# EAGLE design ADE7753Schematic-ATMEGA (EAGLE 6.5.0)
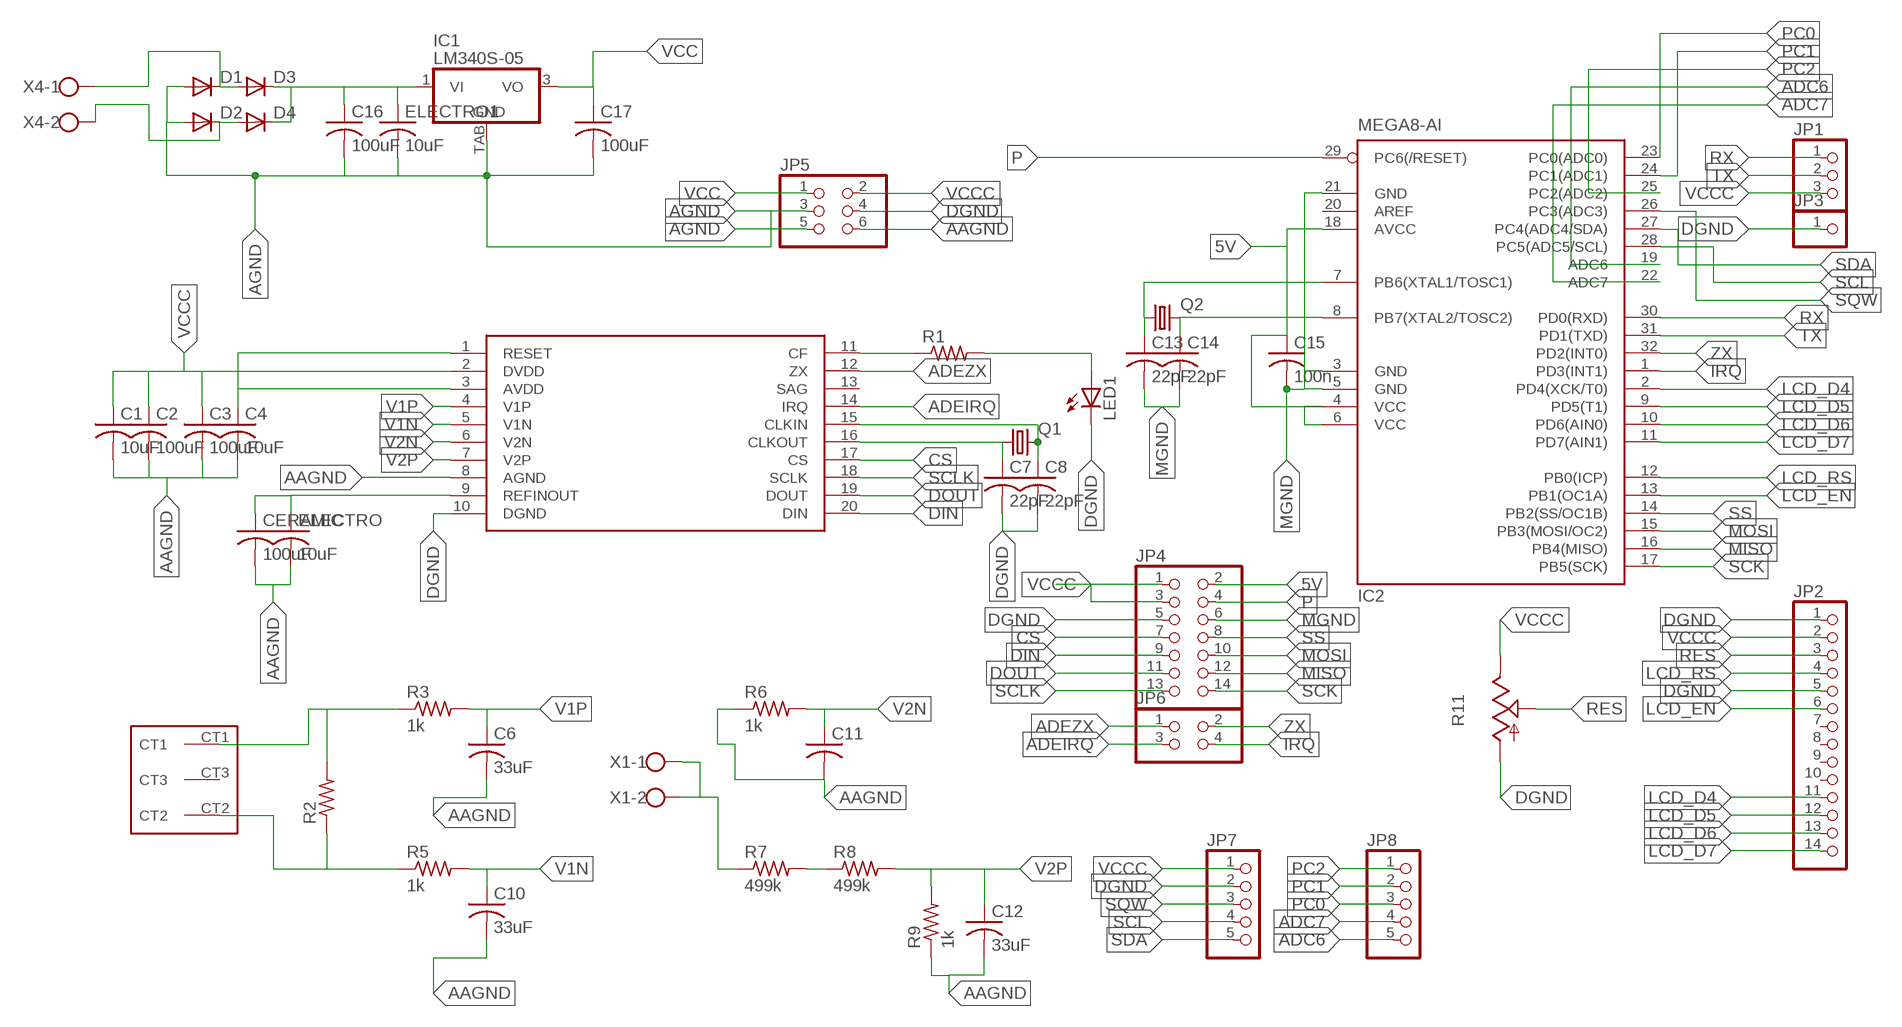
[diagram p0: schematic, sheet 1]

## Parts
C1  10uF  C-US025-030X050  [C025-030X050]
C2  100uF  C-USC0603K  [C0603K]
C3  100uF  C-USC0603K  [C0603K]
C4  10uF  C-US025-030X050  [C025-030X050]
C6  33uF  C-USC0805K  [C0805K]
C7  22pF  C-USC0603K  [C0603K]
C8  22pF  C-USC0603K  [C0603K]
C10  33uF  C-USC0805K  [C0805K]
C11  C-USC0805K  [C0805K]
C12  33uF  C-USC0805K  [C0805K]
C13  22pF  C-USC0603K  [C0603K]
C14  22pF  C-USC0603K  [C0603K]
C15  100n  C-USC0603K  [C0603K]
C16  100uF  C-USC0603K  [C0603K]
C17  100uF  C-USC0603K  [C0603K]
CERAMIC  100uF  C-USC0603K  [C0603K]
D1  DIODE-SMB  [SMB]
D2  DIODE-SMB  [SMB]
D3  DIODE-SMB  [SMB]
D4  DIODE-SMB  [SMB]
ELECTRO  10uF  C-US025-030X050  [C025-030X050]
ELECTRO1  10uF  C-US025-030X050  [C025-030X050]
IC1  LM340S-05  [TO263-3]
IC2  MEGA8-AI  [TQFP32-08]
JP1  PINHD-1X3CB  [1X03-CLEANBIG]
JP2  PINHD-1X14-CB  [1X14-CB]
JP3  PINHD-1X1CB  [1X01-CLEANBIG]
JP4  PINHD-2X7  [2X07]
JP5  PINHD-2X3  [2X03]
JP6  PINHD-2X2  [2X02]
JP7  PINHD-1X5  [1X05]
JP8  PINHD-1X5  [1X05]
LED1  LEDCHIPLED_0805  [CHIPLED_0805]
Q1  CRYSTALHC49S  [HC49/S]
Q2  CRYSTALHC49UP  [HC49UP]
R1  R-US_R1206  [R1206]
R2  R-US_0309/12  [0309/12]
R3  1k  R-US_R1206  [R1206]
R5  1k  R-US_R1206  [R1206]
R6  1k  R-US_R1206  [R1206]
R7  499k  R-US_R1206  [R1206]
R8  499k  R-US_R1206  [R1206]
R9  1k  R-US_R1206  [R1206]
R11  TRIM_US-RJ9W  [RJ9W]
U$1  ADE7753  [SSOP20]
U$2  CURRENTXFORMER  [3PINS]
X1  W239-302  [W239-302]
X4  W237-102  [W237-102]

## Nets
5V: C15.1 IC2.4(VCC) IC2.6(VCC) IC2.18(AVCC) JP4.2
AAGND: C1.2 C2.2 C3.2 C4.2 C6.2 C10.2 C11.2 C12.2 CERAMIC.2 ELECTRO.2 JP5.6 R6.1 R9.1 U$1.8(AGND)
ADC6: IC2.19(ADC6) JP8.5
ADC7: IC2.22(ADC7) JP8.4
ADEIRQ: JP6.3 U$1.14(IRQ)
ADEZX: JP6.1 U$1.12(ZX)
AGND: C16.2 C17.2 D1.A D2.A ELECTRO1.2 IC1.TAB(GND) JP5.3 JP5.5
CS: JP4.7 U$1.17(CS)
DGND: C7.2 C8.2 JP2.1 JP2.5 JP3.1 JP4.5 JP5.4 JP7.2 LED1.C R11.A U$1.10(DGND)
DIN: JP4.9 U$1.20(DIN)
DOUT: JP4.11 U$1.19(DOUT)
IRQ: IC2.1(PD3(INT1)) JP6.4
LCD_D4: IC2.2(PD4(XCK/T0)) JP2.11
LCD_D5: IC2.9(PD5(T1)) JP2.12
LCD_D6: IC2.10(PD6(AIN0)) JP2.13
LCD_D7: IC2.11(PD7(AIN1)) JP2.14
LCD_EN: IC2.13(PB1(OC1A)) JP2.6
LCD_RS: IC2.12(PB0(ICP)) JP2.4
MGND: C13.2 C14.2 C15.2 IC2.3(GND) IC2.5(GND) IC2.21(GND) JP4.6
MISO: IC2.16(PB4(MISO)) JP4.12
MOSI: IC2.15(PB3(MOSI/OC2)) JP4.10
N$1: D1.C D3.A X4.1
N$2: C8.1 Q1.2 U$1.15(CLKIN)
N$3: CERAMIC.1 ELECTRO.1 U$1.9(REFINOUT)
N$4: C7.1 Q1.1 U$1.16(CLKOUT)
N$5: R1.1 U$1.11(CF)
N$6: LED1.A R1.2
N$7: R2.2 R3.1 U$2.CT1
N$9: R2.1 R5.1 U$2.CT2
N$11: R7.2 R8.1
N$12: C14.1 IC2.8(PB7(XTAL2/TOSC2)) Q2.2
N$13: R7.1 X1.1 X1.2
N$14: C13.1 IC2.7(PB6(XTAL1/TOSC1)) Q2.1
N$16: D2.C D4.A X4.2
N$20: C16.1 D3.C D4.C ELECTRO1.1 IC1.1(VI)
P: IC2.29(PC6(/RESET)) JP4.4
PC0: IC2.23(PC0(ADC0)) JP8.3
PC1: IC2.24(PC1(ADC1)) JP8.2
PC2: IC2.25(PC2(ADC2)) JP8.1
RES: JP2.3 R11.S
RX: IC2.30(PD0(RXD)) JP1.1
SCK: IC2.17(PB5(SCK)) JP4.14
SCL: IC2.28(PC5(ADC5/SCL)) JP7.4
SCLK: JP4.13 U$1.18(SCLK)
SDA: IC2.27(PC4(ADC4/SDA)) JP7.5
SQW: IC2.26(PC3(ADC3)) JP7.3
SS: IC2.14(PB2(SS/OC1B)) JP4.8
TX: IC2.31(PD1(TXD)) JP1.2
V1N: C10.1 R5.2 U$1.5(V1N)
V1P: C6.1 R3.2 U$1.4(V1P)
V2N: C11.1 R6.2 U$1.6(V2N)
V2P: C12.1 R8.2 R9.2 U$1.7(V2P)
VCC: C17.1 IC1.3(VO) JP5.1
VCCC: C1.1 C2.1 C3.1 C4.1 JP1.3 JP2.2 JP4.1 JP4.3 JP5.2 JP7.1 R11.E U$1.1(RESET) U$1.2(DVDD) U$1.3(AVDD)
ZX: IC2.32(PD2(INT0)) JP6.2
Unconnected: IC2.20(AREF) JP2.7 JP2.8 JP2.9 JP2.10 U$1.13(SAG) U$2.CT3

## Library data of the parts
C1-C4 C6-C8 C10-C17 CERAMIC ELECTRO ELECTRO1 = rcl:C-US: CAPACITOR, American symbol
D1-D4 = diode:DIODE-: DIODE
IC1 = linear:LM340?-*: Positive VOLTAGE REGULATOR Source: http://cache.national.com/ds/LM/LM340.pdf
IC2 = atmel:MEGA8: MICROCONTROLLER 8 Kbytes FLASH, 1 kbytes SRAM, 512 bytes EEPROM, USART, 6-channel 10 bit ADC, 2-channel 8 bit ADC Pin compatible with Atmega48, ATMega88, ATMega168 Source: avr.lbr; MPN: ATMEGA8-16AU; OC_FARNELL: 9171371; OC_NEWARK: 73M8863
JP1 = adafruit:PINHD-1X3: PIN HEADER
JP2 = adafruit:PINHD-1X14: PIN HEADER
JP3 = adafruit:PINHD-1X1: Pin header 1x1 for 0.1" spacing With round pins
JP4 = pinhead:PINHD-2X7: PIN HEADER
JP5 = pinhead:PINHD-2X3: PIN HEADER
JP6 = pinhead:PINHD-2X2: PIN HEADER
JP7 JP8 = pinhead:PINHD-1X5: PIN HEADER
LED1 = adafruit:LED: LED OSRAM: - CHIPLED LG R971, LG N971, LY N971, LG Q971, LY Q971, LO R971, LY R971 LH N974, LH R974 LS Q976, LO Q976, LY Q976 LO Q996 - Hyper CHIPLED LW Q18S LB Q993, LB Q99A, LB R99A - SideLED LS A670, LO A670, LY A670, LG A670, LP A670 LB A673, LV A673, LT A673, LW A673 LH A674 LY A675 LS A676, LA A676, LO A676, LY A676, LW A676 LS A679, LY A679, LG A679 - Hyper Micro SIDELED® LS Y876, LA Y876, LO Y876, LY Y876 LT Y87S - SmartLED LW L88C, LW L88S LB L89C, LB L89S, LG L890 LS L89K, LO L89K, LY L89K LS L896, LA L896, LO L896, LY L896 - TOPLED LS T670, LO T670, LY T670, LG T670, LP T670 LSG T670, LSP T670, LSY T670, LOP T670, LYG T670 LG T671, LOG T671, LSG T671 LB T673, LV T673, LT T673, LW T673 LH T674 LS T676, LA T676, LO T676, LY T676, LB T676, LH T676, LSB T676, LW T676 LB T67C, LV T67C, LT T67C, LS T67K, LO T67K, LY T67K, LW E67C LS E67B, LA E67B, LO E67B, LY E67B, LB E67C, LV E67C, LT E67C LW T67C LS T679, LY T679, LG T679 LS T770, LO T770, LY T770, LG T770, LP T770 LB T773, LV T773, LT T773, LW T773 LH T774 LS E675, LA E675, LY E675, LS T675 LS T776, LA T776, LO T776, LY T776, LB T776 LHGB T686 LT T68C, LB T68C - Hyper Mini TOPLED® LB M676 - Mini TOPLED Santana® LG M470 LS M47K, LO M47K, LY M47K Source: http://www.osram.convergy.de/
Q1 = adafruit:CRYSTAL: CRYSTAL; OC_FARNELL: 1667008; OC_NEWARK: unknown
Q2 = crystal:CRYSTAL: CRYSTAL; OC_FARNELL: unknown; OC_NEWARK: unknown
R1 R3 R5-R9 = adafruit:R-US_: RESISTOR, American symbol
R2 = resistor:R-US_: RESISTOR, American symbol
R11 = pot:TRIM_US-: POTENTIOMETER
U$1 = ade7735:ADE7753
U$2 = currentxformer:CURRENTXFORMER
X1 = con-wago-500:W239-302: WAGO SCREW CLAMP; OC_FARNELL: unknown; OC_NEWARK: unknown
X4 = con-wago-500:W237-102: WAGO SCREW CLAMP; MPN: 237-102; OC_FARNELL: unknown; OC_NEWARK: 70K9898

## Net classes
0 default: clearance 0.762 mm

## Board
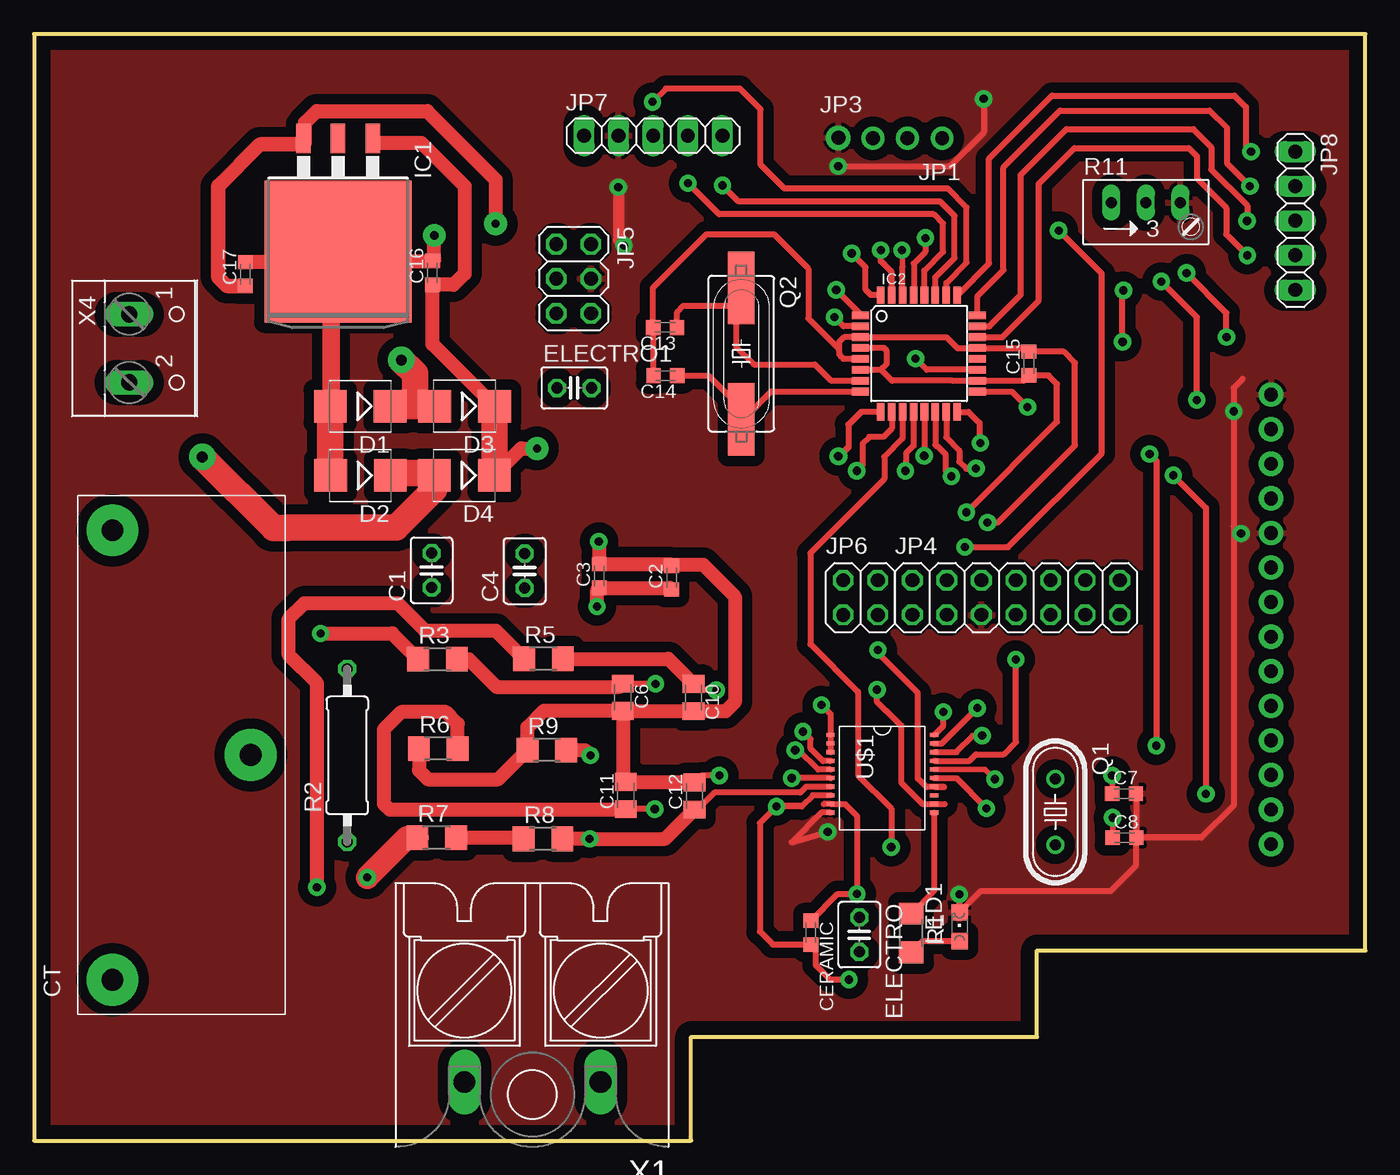
[diagram p1: board, top side]
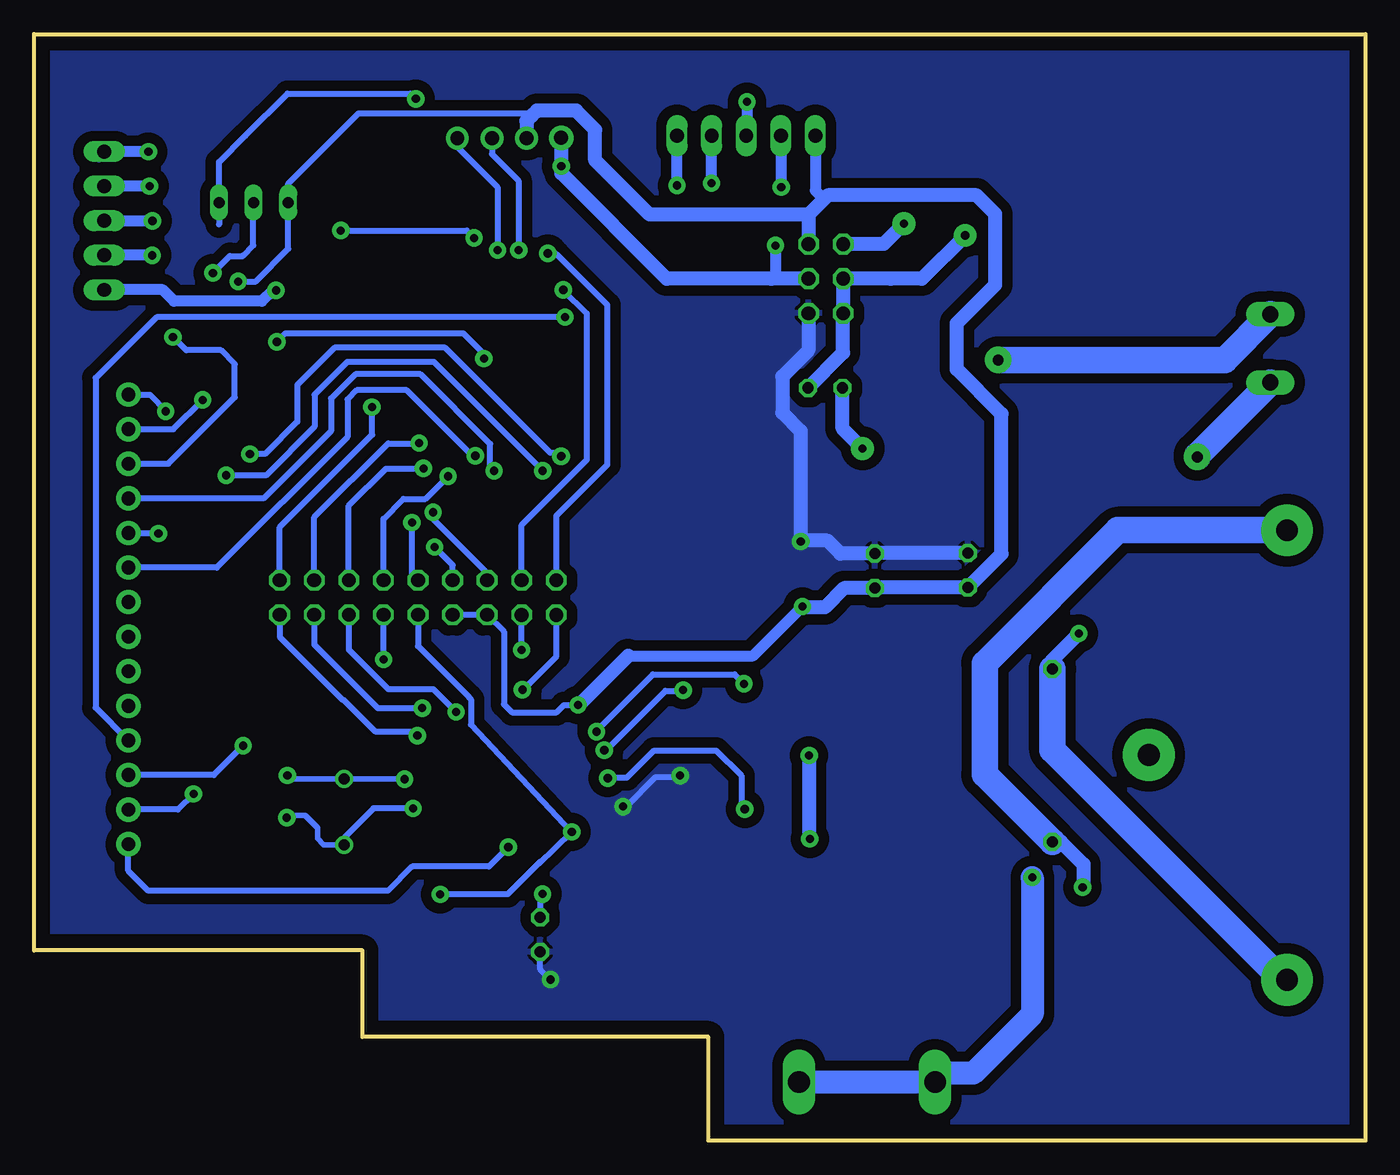
[diagram p2: board, bottom side, seen from below]

Size 97.79 x 81.28 mm. Coordinates in mm from the lower left corner, seen from the top.
Outline: 0,81.28 0,0 48.26,0 48.26,7.62 73.66,7.62 73.66,13.97 97.79,13.97 97.79,81.28 0,81.28
Copper layers (1*16): Top 0.035mm / dielectric 1.5mm / Bottom 0.035mm
Design rules "default": minimum track width 10mil, minimum drill 24mil, track to track 8mil, track to pad 8mil, pad to pad 8mil, via to via 8mil, smd to smd 8mil, copper to edge 40mil, drill to drill 8mil, minimum pad ring 10mil, minimum via ring 8mil, stop-mask expansion 4mil, vias tented up to drill 0mil, thermal gap 10mil

### Footprints (pad centres in the part's own frame; a part is rotated, then mirrored left to right if it is on the bottom)
C025-030X050 = drill 0.813 octagon: 1 -1.27,0; 2 1.27,0
C0603K = smd 1.05 x 1.08: 1 -0.875,0; 2 0.875,0
C0805K = smd 1.3 x 1.6: 1 -1,0; 2 1,0
SMB = smd 2.4 x 2.4: A 2.2,0; C -2.2,0
TO263-3 = smd 1.067 x 2.159: 1 -2.54,-5.791; 2 0,-5.791; 3 2.54,-5.791 | smd 10.8 x 10.41: TAB 0,2.54
TQFP32-08 = smd 1.27 x 0.559: 1 -4.293,2.8; 2 -4.293,2; 3 -4.293,1.2; 4 -4.293,0.4; 5 -4.293,-0.4; 6 -4.293,-1.2; 7 -4.293,-2; 8 -4.293,-2.8; 17 4.293,-2.8; 18 4.293,-2; 19 4.293,-1.2; 20 4.293,-0.4; 21 4.293,0.4; 22 4.293,1.2; 23 4.293,2; 24 4.293,2.8 | smd 0.559 x 1.27: 9 -2.8,-4.293; 10 -2,-4.293; 11 -1.2,-4.293; 12 -0.4,-4.293; 13 0.4,-4.293; 14 1.2,-4.293; 15 2,-4.293; 16 2.8,-4.293; 25 2.8,4.293; 26 2,4.293; 27 1.2,4.293; 28 0.4,4.293; 29 -0.4,4.293; 30 -1.2,4.293; 31 -2,4.293; 32 -2.8,4.293
1X03-CLEANBIG = drill 1.016 pad 1.676: 1 -2.54,0; 2 0,0; 3 2.54,0
1X14-CB = drill 1.016 pad 1.778: 1 -16.51,0; 2 -13.97,0; 3 -11.43,0; 4 -8.89,0; 5 -6.35,0; 6 -3.81,0; 7 -1.27,0; 8 1.27,0; 9 3.81,0; 10 6.35,0; 11 8.89,0; 12 11.43,0; 13 13.97,0; 14 16.51,0
1X01-CLEANBIG = drill 1.016 pad 1.778: 1 0,0
2X07 = drill 1.016 octagon: 1 -7.62,-1.27; 2 -7.62,1.27; 3 -5.08,-1.27; 4 -5.08,1.27; 5 -2.54,-1.27; 6 -2.54,1.27; 7 0,-1.27; 8 0,1.27; 9 2.54,-1.27; 10 2.54,1.27; 11 5.08,-1.27; 12 5.08,1.27; 13 7.62,-1.27; 14 7.62,1.27
2X03 = drill 1.016 octagon: 1 -2.54,-1.27; 2 -2.54,1.27; 3 0,-1.27; 4 0,1.27; 5 2.54,-1.27; 6 2.54,1.27
2X02 = drill 1.016 octagon: 1 -1.27,-1.27; 2 -1.27,1.27; 3 1.27,-1.27; 4 1.27,1.27
1X05 = drill 1.016 long: 1 -5.08,0; 2 -2.54,0; 3 0,0; 4 2.54,0; 5 5.08,0
CHIPLED_0805 = smd 1.2 x 1.2: A 0,-1.05; C 0,1.05
HC49/S = drill 0.813: 1 -2.413,0; 2 2.413,0
HC49UP = smd 5.334 x 1.93: 1 -4.826,0; 2 4.826,0
R1206 = smd 1.6 x 1.803: 1 -1.422,0; 2 1.422,0
0309/12 = drill 0.813 octagon: 1 -6.35,0; 2 6.35,0
RJ9W = drill 0.813 long: A 2.54,0.635; E -2.54,0.635; S 0,0.635
SSOP20 = smd 0.305 x 0.61: 1 -3.493,-3.81; 2 -2.857,-3.81; 3 -2.223,-3.81; 4 -1.587,-3.81; 5 -0.953,-3.81; 6 -0.318,-3.81; 7 0.318,-3.81; 8 0.953,-3.81; 9 1.587,-3.81; 10 2.223,-3.81; 11 2.223,3.81; 12 1.587,3.81; 13 0.953,3.81; 14 0.318,3.81; 15 -0.318,3.81; 16 -0.953,3.81; 17 -1.587,3.81; 18 -2.223,3.81; 19 -2.857,3.81; 20 -3.493,3.81
3PINS = drill 1.6 pad 3.81: CT1 -16.51,10.16; CT2 16.51,10.16; CT3 0,0
W239-302 = drill 1.6 long: 1 -5,5; 2 5,5
W237-102 = drill 1.194 long: 1 -2.5,-1.27; 2 2.5,-1.27

### Placement (x,y rotation side)
C1  29.2,41.89 90 top
C2  46.83,41.35 90 top
C3  41.51,41.48 90 top
C4  36.03,41.85 90 top
C6  43.24,32.56 270 top
C7  80.06,25.49 0 top
C8  80.08,22.25 0 top
C10  48.44,32.54 270 top
C11  43.47,25.35 90 top
C12  48.51,25.31 90 top
C13  46.35,59.72 180 top
C14  46.37,56.19 180 top
C15  73.07,57.08 90 top
C16  29.27,63.74 90 top
C17  15.53,63.65 90 top
CERAMIC  57.06,15.28 270 top
D1  23.96,53.94 180 top
D2  23.98,48.86 180 top
D3  31.62,53.94 180 top
D4  31.6,48.86 180 top
ELECTRO  60.61,15.12 270 top
ELECTRO1  39.67,55.29 0 top
IC1  22.33,67.83 180 top
IC2  65,57.82 0 top
JP1  64.16,73.63 180 top
JP2  90.86,38.28 270 top
JP3  59.07,73.65 0 top
JP4  72.13,39.89 0 top
JP5  39.63,63.31 270 top
JP6  60.7,39.89 0 top
JP7  45.48,73.81 0 top
JP8  92.64,67.57 270 top
LED1  67.97,15.71 0 top
Q1  75.01,24.15 270 top
Q2  51.95,57.81 270 top
R1  64.43,15.25 270 top
R2  23.01,28.3 90 top
R3  29.63,35.35 0 top
R5  37.41,35.39 0 top
R6  29.69,28.8 0 top
R7  29.57,22.25 0 top
R8  37.38,22.16 0 top
R9  37.66,28.69 0 top
R11  81.66,68.27 0 top
U$1  62.31,26.31 270 top
U$2  15.92,28.32 90 top
X1  36.61,9.3 180 top
X4  8.26,58.2 270 top

### Tracks (layer width: path | path; a pad name or v marks a point on that pad's centre or on a via)
5V  (via drill 0.6 pad 1.27)
  Top 0.432: 67.47,55.82 63.01,55.82 62.21,56.62
  Top 0.457: IC2.6 62.21,56.62 62.63,57.04 62.63,58.02 62.43,58.22 IC2.4 | 67.47,55.82 IC2.18 72.68,55.82 C15.1 74.5,56.2 75.13,55.57 75.13,52.8 v68.48,46.15
  Bottom 0.457: JP4.2 64.48,41.18 64.48,41.67 68.48,45.66 v68.48,46.15
AAGND  (via drill 0.6 pad 1.27)
  Top 0.432: U$1.8 58.49,25.37 57.21,25.37 56.38,24.54 v54.52,24.54 | v50.33,26.81 49.01,26.81 C12.2 | CERAMIC.2 57.4,14.06 57.4,12.9 58.47,11.83 v59.85,11.83
  Top 0.457: 56.38,24.54 56.34,24.58 54.56,24.58 53.32,23.34 53.32,15.35 54.27,14.4 CERAMIC.2
  Top 1.016: R6.1 28.27,27.2 28.93,26.54 34.09,26.54 R9.1 36.24,30.35 37.47,31.58 43.23,31.58 C6.2 | C6.2 43.24,26.57 C11.2 48.47,26.35 C12.2 | C6.2 48.42,31.56 C10.2 50.79,31.54 51.47,32.22 51.47,39.96 49.14,42.3 46.9,42.3 C2.2 46.7,42.35 C3.2 41.48,42.38 v41.48,44
  Bottom 0.432: v54.52,24.54 54.5,24.56 54.28,24.56 52.14,26.7 50.44,26.7 v50.33,26.81 | v59.85,11.83 60.61,12.59 ELECTRO.2
  Bottom 1.016: C1.2 35.99,43.16 C4.2 38.56,43.12 39.51,44.07 41.42,44.07 v41.48,44 41.48,52.13 42.83,53.47 42.83,56.12 40.91,58.03 40.91,60.76 JP5.6
  pour Bottom: -1.27,83.82 -1.27,-1.27 99.06,-1.27 99.06,83.82
ADC6  (via drill 0.6 pad 1.27)
  Top 0.432: IC2.19 65.56,56.62 v64.75,57.44 | v79.95,58.67 79.95,62.38 v80.02,62.45
  Bottom 0.432: v64.75,57.44 64.75,57.78 66.24,59.28 79.34,59.28 v79.95,58.67
  Bottom 0.813: v80.02,62.45 80.26,62.45 81.05,61.66 87.5,61.66 88.34,62.49 JP8.5
ADC7  (via drill 0.6 pad 1.27)
  Top 0.432: IC2.22 71.11,59.02 73.8,61.7 73.8,70.29 76.41,72.9 84.81,72.9 85.41,72.3 85.41,70.68 87.56,68.52 87.56,66.58 v89.11,65.03
  Bottom 0.813: v89.11,65.03 JP8.4
ADEIRQ  (via drill 0.6 pad 1.27)
  Top 0.432: U$1.14 66.8,25.99 66.83,25.96 65.55,25.96 64.91,26.6 64.91,31.23 64.91,32.89 61.98,35.82 v61.98,36.03
  Bottom 0.432: v61.98,36.03 61.97,36.04 JP6.3
ADEZX  (via drill 0.6 pad 1.27)
  Top 0.432: U$1.12 66.87,24.72 66.88,24.71 65.27,24.71 63.71,26.27 63.71,30.46 62.59,31.58 62.55,31.58 61.92,32.22 v61.92,33.12
  Bottom 0.432: v61.92,33.12 61.88,33.12 59.43,35.57 JP6.1
AGND  (via drill 0.6 pad 1.68)
  Top 1.016: 21.82,64.95 21.39,64.52 C17.2 21.56,64.52 IC1.TAB 23.01,64.61 C16.2 29.4,64.75 v29.4,66.49
  Top 1.27: D1.A 21.82,54 21.82,64.95
  Top 1.93: D1.A 21.76,48.88 D2.A
  Bottom 1.016: ELECTRO1.2 38.36,57.87 JP5.5 JP5.3 34.88,63.31 34.87,63.3 32.58,63.3 v29.4,66.49
CS  (via drill 0.6 pad 1.27)
  Top 0.432: U$1.17 68.71,27.9 69.19,28.38 71.23,28.38 72.12,29.28 v72.12,35.34
  Bottom 0.432: v72.12,35.34 JP4.7
DGND  (via drill 0.6 pad 1.27)
  Top 0.432: U$1.10 58.49,24.1 57.83,24.1 55.66,21.92 v58.3,22.67 | v67.96,18.09 67.97,18.07 LED1.C 69.54,18.33 79.07,18.33 80.96,20.22 C8.2 80.96,25.46 C7.2 | v69.75,76.52 69.75,74.05 67.25,71.55 59.09,71.55 v59.06,71.58
  Top 0.457: 88.12,45.12 v88.12,53.56 88.11,53.57 88.11,55.28 88.77,55.95 | 88.12,45.12 v88.65,44.59 | 88.12,45.12 88.12,24.63 85.75,22.26 80.97,22.26 C8.2
  Top 0.813: v42.91,70.03 42.91,66.17 v43.34,65.75
  Bottom 0.432: 64.85,18.09 v67.96,18.09 | JP4.5 69.59,36.32 65.84,32.57 65.84,32.56 65.69,32.42 65.69,30.56 v58.3,22.67 | 82.27,73.8 79.17,76.9 70.13,76.9 v69.75,76.52
  Bottom 0.457: JP2.1 89.26,54.79 88.07,53.6 88.11,53.53 v88.12,53.56 | v88.65,44.59 90.82,44.59 JP2.5 | 84.2,67.29 R11.A 84.2,71.87 82.27,73.8 | v58.3,22.67 60.73,20.34 60.6,20.49 63.01,18.09 64.85,18.09
  Bottom 0.813: JP7.2 42.94,70.06 v42.91,70.03 | v43.34,65.75 43.34,63.6 43.63,63.31
  Bottom 1.016: JP5.4 43.63,63.31 51.32,63.31 59.06,71.05 v59.06,71.58 JP3.1
  pour Top: -1.27,83.82 -1.27,-1.27 99.06,-1.27 99.06,83.82
DIN  (via drill 0.6 pad 1.27)
  Top 0.432: U$1.20 66.79,30.47 v66.79,31.48
  Bottom 0.432: 66.83,31.69 66.83,31.52 v66.79,31.48 68.48,33.17 71.77,33.17 74.67,36.07 JP4.9
DOUT  (via drill 0.6 pad 1.27)
  Top 0.432: U$1.19 66.68,29.17 v69.28,31.77
  Bottom 0.432: 69.37,31.74 69.34,31.77 v69.28,31.77 v69.28,31.76 72.54,31.76 77.21,36.43 JP4.11
IRQ  (via drill 0.6 pad 1.27)
  Top 0.432: IC2.1 60.7,60.7 v58.92,62.48
  Bottom 0.432: 58.83,62.75 58.92,62.66 v58.92,62.48 57.19,60.75 57.19,50.01 61.97,45.23 JP6.4
LCD_D4  (via drill 0.6 pad 1.27)
  Top 0.457: IC2.2 59.45,59.82 v58.79,60.48
  Bottom 0.457: v58.79,60.48 88.8,60.48 93.27,56.02 93.27,31.8 JP2.11
LCD_D5  (via drill 0.6 pad 1.27)
  Top 0.457: v59.09,50.27 59.64,50.81 59.72,50.81 59.81,50.91 59.81,52.6 60.74,53.52 IC2.9 62.19,53.52 60.78,53.52 59.82,52.55 59.82,50.91 59.17,50.27 v59.07,50.27 | v81.93,50.43 82.44,49.93 v82.44,29.01
  Bottom 0.457: v59.09,50.27 59.02,50.27 58.98,50.23 | v59.07,50.27 59.3,50.51 59.87,50.51 67.59,58.23 75.72,58.23 78.46,55.5 78.46,52.8 80.83,50.43 v81.93,50.43 | v82.44,29.01 84.59,26.85 JP2.12
LCD_D6  (via drill 0.6 pad 1.27)
  Top 0.457: IC2.10 63,52.3 62.38,51.68 61.35,51.68 60.86,51.19 60.86,49.64 v60.43,49.19 60.36,49.13 60.36,49.04 60.44,49.23 v60.44,49.2 | v83.68,48.86 86.08,46.47 v86.08,25.47
  Bottom 0.457: v60.43,49.19 60.41,49.19 60.39,49.22 | v60.44,49.2 68.42,57.19 74.79,57.19 77.18,54.79 77.18,52.43 80.75,48.86 v83.68,48.86 | v86.08,25.47 87.23,24.31 JP2.13
LCD_D7  (via drill 0.6 pad 1.27)
  Top 0.457: IC2.11 63.77,53.5 63.77,51.55 62.45,50.22 62.45,48.59 57.01,43.15 57.01,36.47 60.52,32.96 60.52,26.83 62.96,24.39 v62.96,21.55
  Bottom 0.457: v62.96,21.55 64.38,20.13 70.01,20.13 71.79,18.36 89.4,18.36 90.86,19.81 JP2.14
LCD_EN  (via drill 0.6 pad 1.27)
  Top 0.457: IC2.13 65.4,50.31 v65.38,50.29
  Bottom 0.432: 65.47,50.17 70.42,55.11 74.09,55.11 74.76,54.45 74.76,51.7 84.36,42.09 JP2.6
  Bottom 0.457: v65.38,50.29 65.38,50.26 65.47,50.17
LCD_RS  (via drill 0.6 pad 1.27)
  Top 0.457: IC2.12 64.6,51.04 64.04,50.49 64.04,49.23 v64,49.2
  Bottom 0.432: 63.98,49.2 64.28,49.5 64.28,51.17 69.42,56.3 74.19,56.3 75.98,54.5 75.98,52.12 80.93,47.17 JP2.4
  Bottom 0.457: v64,49.2 63.98,49.2
MGND  (via drill 0.6 pad 1.27)
  Top 0.432: v70.03,45.41 70.81,45.41 76.46,51.06 76.46,57.13 75.65,57.94 72.78,57.94 72.51,58.22 | C13.2 45.48,62.66 49.38,66.57 54.35,66.57 56.88,64.04 56.88,60.39 59.14,58.13
  Top 0.457: C13.2 45.48,56.21 C14.2 | IC2.5 59.45,57.42 59.19,57.67 59.19,57.7 59.14,57.76 59.14,58.13 59.14,58.66 59.5,59.02 IC2.3 67.01,59.02 67.82,58.21 69.28,58.21 IC2.21 72.51,58.22 72.8,58.22 C15.2
  Bottom 0.432: JP4.6 70.03,41.6 v70.03,45.41
MISO  (via drill 0.6 pad 1.27)
  Top 0.457: IC2.16 68.64,53.52 69.44,52.72 69.44,51.29 v69.5,51.23
  Bottom 0.457: 69.58,51.08 69.5,51.16 v69.5,51.23 69.52,51.21 71.78,51.21 77.21,45.79 JP4.12
MOSI  (via drill 0.6 pad 1.27)
  Top 0.457: IC2.15 67,51.66 67.96,50.7 67.96,49.86 68.47,49.35 69.17,49.35 v69.19,49.37
  Bottom 0.457: 69.19,49.34 v69.19,49.37 69.2,49.35 71.94,49.35 74.67,46.63 JP4.10
N$1  (via drill 0.8 pad 1.93)
  Top 1.93: D1.C 27.99,53.94 | 27.99,53.94 D3.A | v26.98,57.34 27.99,56.33 27.99,53.94
  Bottom 1.93: X4.1 10.35,57.34 v26.98,57.34
N$2  (via drill 0.6 pad 1.27)
  Top 0.406: v79.22,23.72 79.22,22.27 C8.1
  Top 0.432: U$1.15 67.73,26.63 v69.95,24.41
  Bottom 0.406: Q1.2 75.53,21.73 76.51,21.73 76.98,22.2 76.98,22.98 77.86,23.87 79.08,23.87 v79.22,23.72
  Bottom 0.432: v69.95,24.41 72.86,24.41 75.53,21.73
N$3  (via drill 0.6 pad 1.27)
  Top 0.432: CERAMIC.1 59.02,18.11 v60.44,18.11 60.44,23.86 59.57,24.73 U$1.9 | U$1.9 | U$1.9 57.99,24.73
  Bottom 0.432: v60.44,18.11 60.61,17.94 ELECTRO.1
N$4  (via drill 0.6 pad 1.27)
  Top 0.406: U$1.16 69.86,27.26 v70.57,26.55 | v79.19,26.83 C7.1
  Bottom 0.406: v70.57,26.55 Q1.1 78.91,26.56 v79.19,26.83
N$5
  Top 0.432: R1.1 66.12,18.36 U$1.11
N$6
  Top 0.432: R1.2 65.26,14.66 LED1.A
N$7  (via drill 0.6 pad 1.27)
  Top 1.016: v21.06,37.25 26.31,37.25 R3.1
  Bottom 1.016: R2.2 23.01,35.3 v21.06,37.25
  Bottom 1.93: U$2.CT1 6.1,11.81 22.99,28.7 22.99,34.63 R2.2
N$9  (via drill 0.6 pad 1.27)
  Top 1.016: v20.78,18.61 20.78,33.6 18.72,35.66 18.72,38.34 19.86,39.48 26.7,39.48 28.71,37.47 33.92,37.47 R5.1
  Bottom 1.016: R2.1 22.36,21.95 20.7,20.29 20.7,18.68 v20.78,18.61
  Bottom 1.93: U$2.CT2 18.18,44.83 27.96,35.06 27.96,26.9 R2.1
N$11
  Top 1.016: R7.2 35.86,22.25 R8.1
N$12
  Top 0.457: C14.1 49.54,56.19 51.48,54.25 51.48,53.45 Q2.2 52.1,52.98 54.14,55.02 IC2.8
N$13  (via drill 0.6 pad 1.27)
  Top 1.676: R7.1 27.4,22.25 v24.48,19.33
  Bottom 1.676: v24.48,19.33 24.48,9.28 28.8,4.96 31.6,4.96 X1.2 X1.1
N$14
  Top 0.457: C13.1 47.23,60.86 47.68,61.32 51.55,61.32 51.57,61.29 | 51.57,61.29 51.57,58.29 52.86,57 57.34,57 58.52,55.83 IC2.7 | Q2.1 51.57,62.26 51.57,61.29
N$16  (via drill 0.8 pad 1.93)
  Top 1.93: v12.36,50.22 17.59,44.99 18.59,44.99 18.62,45.02 26.59,45.02 29.4,47.83 29.4,48.3 | 29.4,48.3 D4.A | D2.C 26.36,49.03 28.5,49.03 29.23,48.3 29.4,48.3
  Bottom 1.93: X4.2 12.36,50.33 v12.36,50.22
N$20  (via drill 0.6 pad 1.68)
  Top 1.016: D3.C 29.27,58.5 C16.1 30.81,62.87 31.63,63.68 31.63,70.1 28.45,73.28 25.21,73.28 IC1.1 | 33.82,48.88 35.78,50.84 v36.94,50.84
  Top 1.93: D3.C 33.82,48.88
  Top 2.184: 33.82,48.88 D4.C
  Bottom 1.016: v36.94,50.84 38.4,52.31 ELECTRO1.1
P  (via drill 0.6 pad 1.27)
  Top 0.432: v68.36,43.59 71.55,43.59 78.42,50.47 78.42,63.69 v75.26,66.85 | 64.63,62.15 IC2.29 64.62,62.14 64.62,64.43 65.47,65.27 v65.47,66.3
  Bottom 0.432: JP4.4 67.05,42.28 v68.36,43.59 | v75.26,66.85 66.02,66.85 v65.47,66.3
PC0  (via drill 0.6 pad 1.27)
  Top 0.432: IC2.23 70.17,59.82 72.48,62.12 72.48,70.95 75.83,74.3 85.15,74.3 86.47,72.98 86.47,71.33 89.09,68.7 v89.09,67.55
  Bottom 0.813: v89.09,67.55 92.63,67.55 JP8.3
PC1  (via drill 0.6 pad 1.27)
  Top 0.432: IC2.24 69.29,62.03 71.21,63.95 71.21,71.5 75.36,75.66 86.34,75.66 87.61,74.38 87.61,71.79 v89.31,70.1
  Bottom 0.813: v89.31,70.1 JP8.2
PC2  (via drill 0.6 pad 1.27)
  Top 0.432: IC2.25 67.84,62.11 70.15,64.42 70.15,72.14 74.77,76.76 88.16,76.76 89.01,75.91 89.01,73.03 v89.39,72.64
  Bottom 0.813: v89.39,72.64 92.66,72.64 93.04,72.26 93.02,72.26 JP8.1
RES  (via drill 0.6 pad 1.27)
  Top 0.457: v87.58,59.02 87.58,60.8 v84.66,63.73
  Bottom 0.457: JP2.3 87.92,49.71 83.04,54.6 83.04,57.03 84.06,58.05 86.61,58.05 v87.58,59.02 | v84.66,63.73 83.41,64.97 82.44,64.97 82.44,65.01 81.68,65.77 81.68,68.88 R11.S
RX  (via drill 0.6 pad 1.27)
  Top 0.406: 63.8,64.2 63.8,65.35 v63.74,65.4
  Top 0.457: IC2.30 63.8,64.2
  Bottom 0.406: v63.74,65.4 63.74,65.55 63.83,65.64
  Bottom 0.457: JP1.1 66.69,72.98 63.75,70.03 v63.75,65.41 v63.74,65.4
SCK  (via drill 0.6 pad 1.27)
  Top 0.457: IC2.17 71.83,55.02 v72.97,53.87
  Bottom 0.457: v72.97,53.87 | v72.97,53.87 73.01,53.84 | v72.98,53.87 v72.97,53.87 | JP4.14 79.75,45.05 72.95,51.85 72.95,53.85 v72.97,53.87
SCL  (via drill 0.6 pad 1.27)
  Top 0.432: IC2.28 65.4,63.91 66.76,65.28 66.76,67.36 66.09,68.04 50.32,68.04 v48.03,70.33
  Bottom 0.813: v48.03,70.33 JP7.4
SCLK  (via drill 0.6 pad 1.27)
  Top 0.432: U$1.18 67.76,28.53 68.95,29.73 69.62,29.73 v69.64,29.75
  Bottom 0.432: 69.76,29.89 69.64,29.76 v69.64,29.75 69.94,30.05 72.75,30.05 75.09,32.4 75.14,32.4 79.75,37 JP4.13
SDA  (via drill 0.6 pad 1.27)
  Top 0.432: IC2.27 66.2,63.42 67.61,64.83 67.61,67.92 66.55,68.98 51.74,68.98 v50.57,70.16
  Bottom 0.813: v50.57,70.16 50.57,73.8 JP7.5
SQW  (via drill 0.6 pad 1.27)
  Top 0.432: IC2.26 67,63 68.5,64.5 68.5,68.54 67.11,69.94 55.1,69.94 53.37,71.67 53.37,75.74 51.84,77.27 46.4,77.27 v45.43,76.3
  Bottom 0.813: v45.43,76.3 45.43,73.86 JP7.3
SS  (via drill 0.6 pad 1.27)
  Top 0.457: IC2.14 66.2,51.11 66.3,51.01 66.36,51.01 66.95,50.42 66.95,49.22 v67.37,48.8
  Bottom 0.457: 67.38,48.7 67.37,48.7 v67.37,48.8 69.04,47.13 70.67,47.13 72.13,45.67 JP4.8
TX  (via drill 0.6 pad 1.27)
  Top 0.457: IC2.31 63,63.79 62.19,64.59 v62.19,65.41
  Bottom 0.406: v62.19,65.41 62.19,65.42 61.89,65.73
  Bottom 0.457: JP1.2 64.16,72.46 62.21,70.52 62.21,65.42 v62.19,65.41
V1N  (via drill 0.6 pad 1.27)
  Top 0.432: U$1.5 57.6,27.26 56.19,28.68 v55.91,28.68 | v50.12,33.09 48.89,33.09 C10.1
  Top 1.016: R5.2 46.58,35.39 C10.1
  Bottom 0.432: v55.91,28.68 v55.9,28.67 55.79,28.67 51.42,33.04 50.17,33.04 v50.12,33.09
V1P  (via drill 0.6 pad 1.27)
  Top 0.432: U$1.4 58.48,27.88 57.96,27.88 57.04,28.8 57.04,29.49 56.49,30.04 v56.48,30.04 | v45.64,33.55 43.25,33.55 C6.1
  Top 1.016: R3.2 31.95,35.35 33.96,33.33 43.01,33.33 C6.1
  Bottom 0.432: v56.48,30.04 56.46,30.06 56.41,30.06 56.41,30.18 52.34,34.24 46.33,34.24 v45.64,33.55
V2N  (via drill 0.6 pad 1.27)
  Top 0.432: U$1.6 v55.65,26.62 | v45.59,24.35 C11.1
  Top 1.016: R6.2 31.11,30.62 30.25,31.47 26.97,31.47 25.69,30.2 25.69,24.73 26.12,24.31 43.43,24.31 C11.1
  Bottom 0.432: v55.65,26.62 55.61,26.67 54.24,26.67 52.25,28.66 47.69,28.66 45.84,26.81 45.84,24.61 v45.59,24.35
V2P  (via drill 0.6 pad 1.27)
  Top 0.432: U$1.7 56.71,25.98 56.29,25.56 49.99,25.56 48.74,24.31 C12.1
  Top 1.016: C12.1 46.36,22.16 v40.81,22.16 R8.2 | R9.2 40.46,28.69 v40.86,28.29
  Bottom 1.016: v40.86,28.29 40.86,22.22 v40.81,22.16
VCC  (via drill 0.6 pad 1.68)
  Top 1.016: IC1.3 19.34,73.18 16.62,73.18 13.49,70.05 13.49,63.47 14.19,62.77 C17.1 14.13,62.78 13.55,63.36 13.55,70.15 16.57,73.18 19.8,73.18 19.91,73.28 19.91,74.77 20.76,75.62 28.87,75.62 33.91,70.58 v33.91,67.34
  Bottom 1.016: v33.91,67.34 35.4,65.85 JP5.1
VCCC  (via drill 0.6 pad 1.27)
  Top 0.432: U$1.3 U$1.2 U$1.1 58.5,31.34 v57.84,31.99
  Top 0.457: v85.41,54.4 85.41,60.49 v82.79,63.1
  Top 1.016: v41.36,39.23 41.36,40.44 C3.1 46.7,40.6 C2.1
  Bottom 0.432: JP4.3 JP4.1 63.28,37.4 63.28,32.05 62.69,31.45 59.41,31.45 58.87,31.99 v57.84,31.99
  Bottom 0.457: JP2.2 87.56,52.25 v85.41,54.4 | v82.79,63.1 81.5,63.1 79.11,65.5 79.11,68.89 R11.E 79.12,70.3 73.96,75.46 61.43,75.46 61.24,75.27
  Bottom 0.813: 54.16,35.61 44.97,35.61 v41.36,39.23 | JP7.1 40.4,69.79 39.77,69.16
  Bottom 1.016: v41.36,39.23 41.29,39.16 39.7,39.16 38.29,40.58 C4.1 35.99,40.62 C1.1 26.73,43.09 26.73,53.38 30.02,56.67 30.02,60.03 27.19,62.86 27.19,68.06 28.57,69.44 39.48,69.44 39.77,69.16 40.9,68.02 | 40.9,68.02 JP5.2 | 40.9,68.02 52.58,68.02 56.57,72.01 56.57,74.25 57.98,75.65 60.85,75.65 61.24,75.27 61.62,74.89 JP1.3 | 54.16,35.61 57.78,31.99 v57.84,31.99
ZX  (via drill 0.6 pad 1.27)
  Top 0.457: IC2.32 61.46,62.11 61.07,62.5 61.07,64.14 60.93,64.29 | 60.93,64.29 | 60.93,64.29 v60.06,65.16
  Bottom 0.406: v60.06,65.16 60.03,65.16 59.94,65.25 | 59.94,65.25 | 59.94,65.25 59.9,65.21
  Bottom 0.432: JP6.2 59.43,45.9 55.68,49.65 55.68,61.38 59.41,65.1 60,65.1 v60.06,65.16